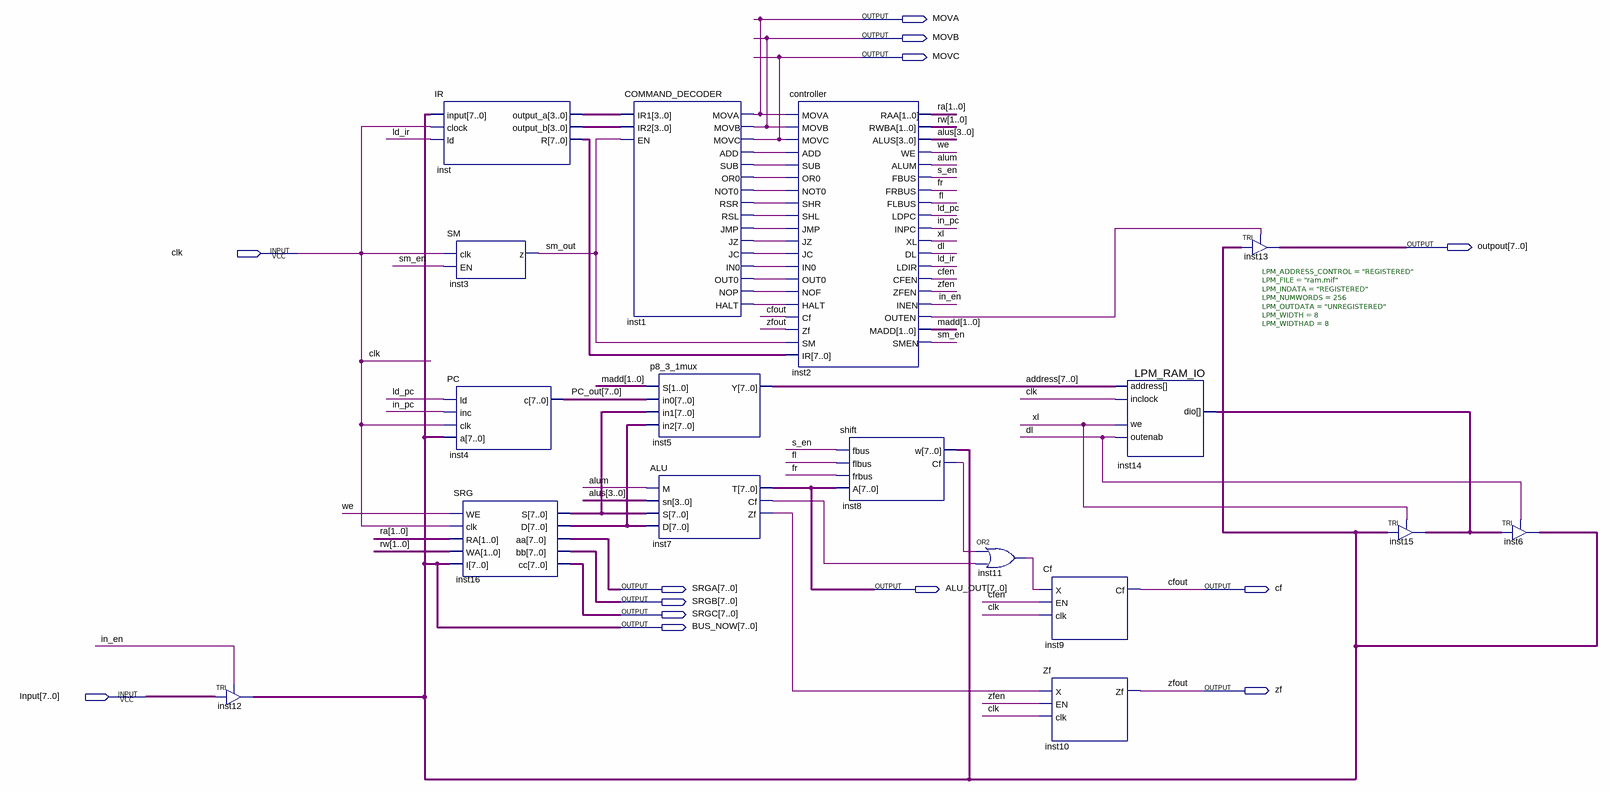
[diagram p0: schematic sheet]
// Quartus schematic CPU.bdf as structural Verilog: 17 symbols, 13 pins
module CPU (
  input  clk,
  input  [7:0] Input,
  output MOVA,
  output MOVB,
  output MOVC,
  output [7:0] outpout,
  output [7:0] SRGA,
  output [7:0] ALU_OUT,
  output cf,
  output [7:0] SRGB,
  output [7:0] SRGC,
  output [7:0] BUS_NOW,
  output zf
);

  wire alum, cfen, dl, fl, fr, in_en, in_pc, inst1_add, inst1_halt, inst1_in0, inst1_jc, inst1_jmp, inst1_jz,
       inst1_nop, inst1_not0, inst1_or0, inst1_out0, inst1_rsl, inst1_rsr, inst1_sub, inst2_outen, inst7_cf,
       inst7_zf, inst8_cf, inst11_out, ld_ir, ld_pc, s_en, sm_en, sm_out, we, xl, zfen;
  wire [1:0] madd, ra, rw;
  wire [3:0] alus, inst_output_a, inst_output_b;
  wire [7:0] address, inst14_dio, inst16_d, inst16_s, inst_r, PC_out;

  TRI inst12[7:0] (.IN(Input), .OE(in_en), .OUT(BUS_NOW));
  IR inst (.\input (BUS_NOW), .clock(clk), .ld(ld_ir), .output_a(inst_output_a), .output_b(inst_output_b), .R(inst_r));
  SM inst3 (.clk(clk), .EN(sm_en), .z(sm_out));
  PC inst4 (.ld(ld_pc), .inc(in_pc), .clk(clk), .a(BUS_NOW), .c(PC_out));
  SRG inst16 (
    .WE(we), .clk(clk), .RA(ra), .WA(rw), .I(BUS_NOW), .S(inst16_s), .D(inst16_d), .aa(SRGA), .bb(SRGB),
    .cc(SRGC));
  COMMAND_DECODER inst1 (
    .IR1(inst_output_a), .IR2(inst_output_b), .EN(sm_out), .MOVA(MOVA), .MOVB(MOVB), .MOVC(MOVC),
    .ADD(inst1_add), .SUB(inst1_sub), .OR0(inst1_or0), .NOT0(inst1_not0), .RSR(inst1_rsr), .RSL(inst1_rsl),
    .JMP(inst1_jmp), .JZ(inst1_jz), .JC(inst1_jc), .IN0(inst1_in0), .OUT0(inst1_out0), .NOP(inst1_nop),
    .HALT(inst1_halt));
  p8_3_1mux inst5 (.S(madd), .in0(PC_out), .in1(inst16_s), .in2(inst16_d), .Y(address));
  ALU inst7 (.M(alum), .sn(alus), .S(inst16_s), .D(inst16_d), .T(ALU_OUT), .Cf(inst7_cf), .Zf(inst7_zf));
  controller inst2 (
    .MOVA(MOVA), .MOVB(MOVB), .MOVC(MOVC), .ADD(inst1_add), .SUB(inst1_sub), .OR0(inst1_or0),
    .NOT0(inst1_not0), .SHR(inst1_rsr), .SHL(inst1_rsl), .JMP(inst1_jmp), .JZ(inst1_jz), .JC(inst1_jc),
    .IN0(inst1_in0), .OUT0(inst1_out0), .NOF(inst1_nop), .HALT(inst1_halt), .Cf(cf), .Zf(zf), .SM(sm_out),
    .IR(inst_r), .RAA(ra), .RWBA(rw), .ALUS(alus), .WE(we), .ALUM(alum), .FBUS(s_en), .FRBUS(fr), .FLBUS(fl),
    .LDPC(ld_pc), .INPC(in_pc), .XL(xl), .DL(dl), .LDIR(ld_ir), .CFEN(cfen), .ZFEN(zfen), .INEN(in_en),
    .OUTEN(inst2_outen), .MADD(madd), .SMEN(sm_en));
  shift inst8 (.fbus(s_en), .flbus(fl), .frbus(fr), .A(ALU_OUT), .w(BUS_NOW), .Cf(inst8_cf));
  or inst11 (inst11_out, inst8_cf, inst7_cf);
  Cf inst9 (.X(inst11_out), .EN(cfen), .clk(clk), .Cf(cf));
  Zf inst10 (.X(inst7_zf), .EN(zfen), .clk(clk), .Zf(zf));
  LPM_RAM_IO #(.LPM_ADDRESS_CONTROL("REGISTERED"), .LPM_FILE("ram.mif"), .LPM_INDATA("REGISTERED"), .LPM_NUMWORDS(256), .LPM_OUTDATA("UNREGISTERED"), .LPM_WIDTH(8), .LPM_WIDTHAD(8)) inst14 (
    .address(address), .inclock(clk), .we(xl), .outenab(dl), .dio(inst14_dio));
  TRI inst13[7:0] (.IN(BUS_NOW), .OE(inst2_outen), .OUT(outpout));
  TRI inst15[7:0] (.IN(BUS_NOW), .OE(xl), .OUT(inst14_dio));
  TRI inst6[7:0] (.IN(inst14_dio), .OE(dl), .OUT(BUS_NOW));

  // Other names for the same wires on the sheet: cfout = cf; zfout = zf
endmodule
